# Altium schematic sheet AVCC_01.SchDoc
size 381 x 241 mm; SheetNumber: 1; SheetTotal: 3
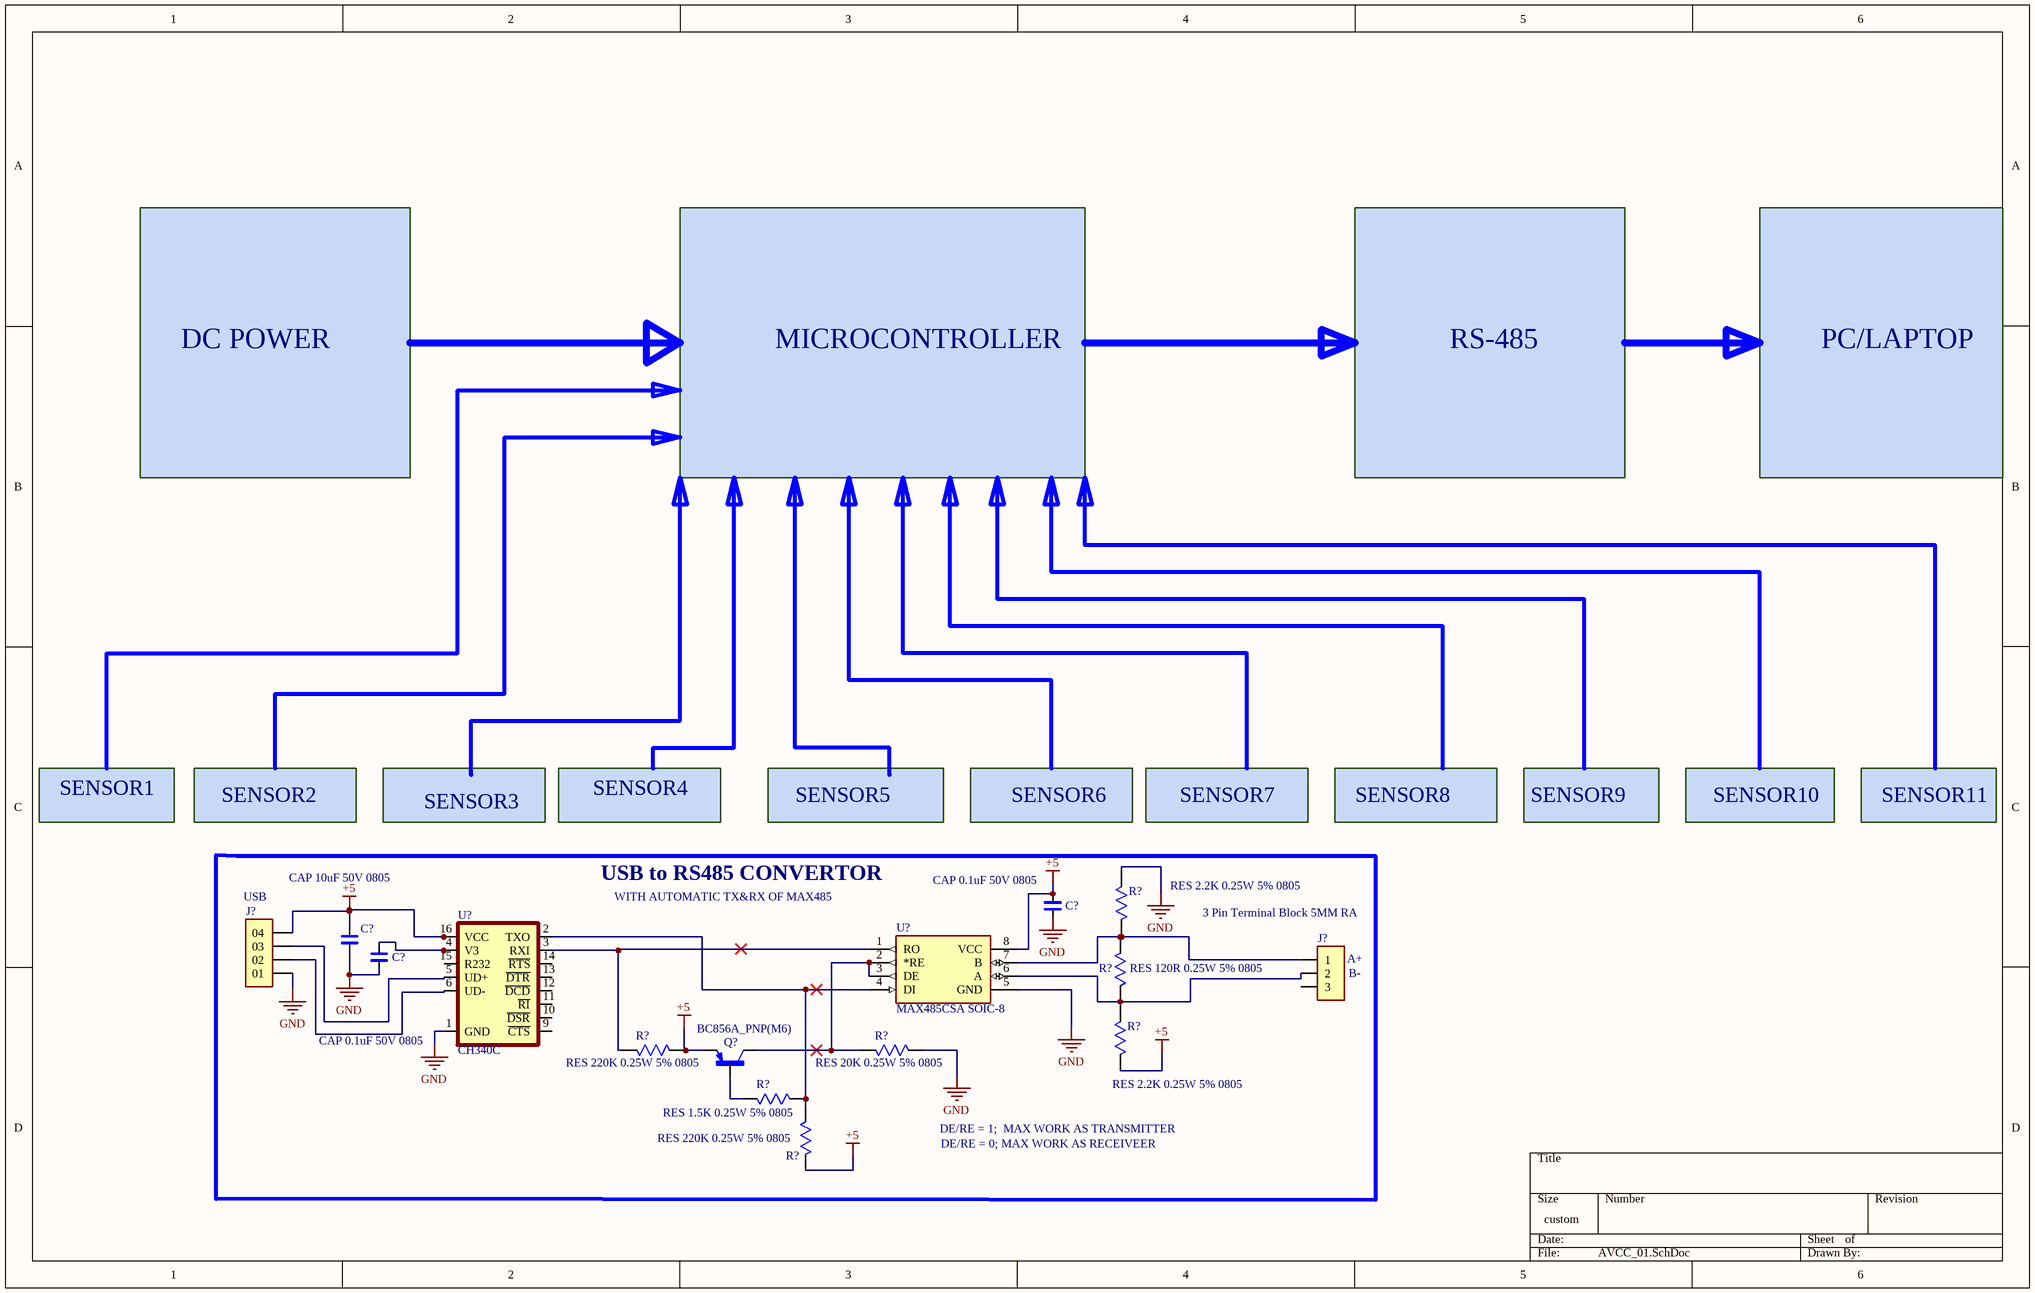
[diagram p0: AVCC_01.SchDoc]

## Parts
(Parts that share a designator on the sheet are numbered #1, #2 ... from top to bottom, then left to right.)
C?#1  CAP 0.1uF 50V 0805  [CAP CER 0.1uF/50V 5%]
C?#2  CAP 10uF 50V 0805  [CAP CER 0.1uF/50V 5%]
C?#3  CAP 0.1uF 50V 0805  [CAP CER 0.1uF/50V 5%]
J?#1  USB  [BURGE 4 PIN 2.54mm]
J?#2  3 Pin Terminal Block 5MM RA  [3 Pin Terminal Block 5MM RA]
Q?  BC856A_PNP(M6)  [TRANS_BC856A_RFG]
R?#1  RES 2.2K 0.25W 5% 0805  [RES 0805 10K/0.25W 5%]
R?#2  RES 120R 0.25W 5% 0805  [RES 0805 10K/0.25W 5%]
R?#3  RES 2.2K 0.25W 5% 0805  [RES 0805 10K/0.25W 5%]
R?#4  RES 220K 0.25W 5% 0805  [RES 0805 10K/0.25W 5%]
R?#5  RES 20K 0.25W 5% 0805  [RES 0805 10K/0.25W 5%]
R?#6  RES 1.5K 0.25W 5% 0805  [RES 0805 10K/0.25W 5%]
R?#7  RES 220K 0.25W 5% 0805  [RES 0805 10K/0.25W 5%]
U?#1  MAX485CSA SOIC-8  [MAX485CSA]
U?#2  CH340C  [SO016]

## Nets
+5: C?#1.1 C?#2.1 J?#1.04 Q?.2(E) R?#3.2 R?#4.2 R?#7.2 U?#1.8(VCC) U?#2.16(VCC)
GND: C?#1.2 C?#2.2 C?#3.2 J?#1.01 R?#1.1 R?#5.2 U?#1.5(GND) U?#2.1(GND)
NetC?#3_1: C?#3.1 U?#2.4(V3)
NetJ?#1_02: J?#1.02 U?#2.6(UD-)
NetJ?#1_03: J?#1.03 U?#2.5(UD+)
NetJ?#2_1: J?#2.1 R?#1.2 R?#2.1 U?#1.7(B)
NetJ?#2_2: J?#2.2 R?#2.2 R?#3.1 U?#1.6(A)
NetQ?_1: Q?.1(B) R?#6.1
NetQ?_3: Q?.3(C) R?#5.1 U?#1.2(*RE) U?#1.3(DE)
NetR?#4_1: R?#4.1 U?#1.1(RO) U?#2.3(RXI)
NetR?#6_2: R?#6.2 R?#7.1 U?#1.4(DI) U?#2.2(TXO)

Not connected (* = marked no-connect by the designer): J?#2 3; U?#2 9(~{CTS}) 10(~{DSR}) 11(~{RI}) 12(~{DCD}) 13(~{DTR}) 14(~{RTS}) 15(R232)

## Notes on the sheet
- DC POWER
- MICROCONTROLLER
- RS-485
- PC/LAPTOP
- SENSOR1
- SENSOR2
- SENSOR3
- SENSOR4
- SENSOR5
- SENSOR6
- SENSOR7
- SENSOR8
- SENSOR9
- SENSOR10
- SENSOR11
- USB to RS485 CONVERTOR
- WITH AUTOMATIC TX&RX OF MAX485
- (near J?#2) A+
- (near J?#2) B-
- DE/RE = 1;  MAX WORK AS TRANSMITTER
- DE/RE = 0; MAX WORK AS RECEIVEER

## Library data of the parts
C?#1-C?#3 = CAP CER 0.1uF/50V 5%: CAP CER 0.1uF/50V  Ceramic Capacitor X7R 0805 (2012 Metric) SMT; MF: Samsung; MP: CL21B104KCFNNNE; Purchase-URL: https://pricing.snapeda.com/search?q=CL21B104KCFNNNE&ref=eda; Package: 0805 Samsung; Check_prices: https://www.snapeda.com/parts/CL21B104KCFNNNE/Samsung+Electro-Mechanics/view-part/?ref=eda; Value: *; SnapEDA_Link: https://www.snapeda.com/parts/CL21B104KCFNNNE/Samsung+Electro-Mechanics/view-part/?ref=snap; Digi-Key_Part_Number: 1276-6840-2-ND
J?#1 = BURGE 4 PIN 2.54mm: Conn Unshrouded Header HDR 4 POS 2.54mm Solder ST Top Entry Thru-Hole Bulk TSW-104-17-G-S-LL; MF: Samtec; MP: TSW-104-23-H-S-LL; SnapEDA_Link: https://www.snapeda.com/parts/TSW-104-23-H-S-LL/Samtec/view-part/?ref=snap; Package: None; Value: *; Check_prices: https://www.snapeda.com/parts/TSW-104-23-H-S-LL/Samtec/view-part/?ref=eda
J?#2 = 3 Pin Terminal Block 5MM RA: 3 Pin Terminal Block HDR 5MM THT RA 231-433_001-000; MP: 231-433/001-000; MF: WAGO; SnapEDA_Link: https://www.snapeda.com/parts/231-433/001-000/WAGO/view-part/482062/?ref=snap; Package: None; Availability: Unavailable; Price: None; Value: *
Q? = BC856A_RFG: Package: None; Price: None; Value: *; MP: BC856A_RFG; Availability: Unavailable
R?#1-R?#7 = RES 10K 0.25W 5% 0805: RESISTOR, THICK FILM, 10K, 5%, 0805 0.25W SMT; MP: ERJ-6GEYJ103V; MF: Panasonic Electronic; Price: None; Check_prices: https://www.snapeda.com/parts/ERJ-6GEYJ103V/Panasonic+Electronic+Components/view-part/?ref=eda; Package: 805-2 Panasonic; Purchase-URL: https://pricing.snapeda.com/search/part/ERJ-6GEYJ103V/?ref=eda; Availability: In Stock; SnapEDA_Link: https://www.snapeda.com/parts/ERJ-6GEYJ103V/Panasonic+Electronic+Components/view-part/?ref=snap; Value: *
U?#1 = MAX485CSA: MAX485CSA-RS-485/RS-422 Transceivers, SOIC-8; MF: Analog Devices; MP: MAX485CSA+; SnapEDA_Link: https://www.snapeda.com/parts/MAX485CSA+/Analog+Devices/view-part/?ref=snap; Package: SOIC-8 Maxim; Value: *; Check_prices: https://www.snapeda.com/parts/MAX485CSA+/Analog+Devices/view-part/?ref=eda
U?#2 = CH340C: Replacement for Brother P-Touch; MF: Olimex; SnapEDA_Link: https://www.snapeda.com/parts/CH340C/Olimex/view-part/?ref=snap; Package: None; Value: *; MP: CH340C; Check_prices: https://www.snapeda.com/parts/CH340C/Olimex/view-part/?ref=eda